# EasyEDA schematic Schematic.json
TITLE: 1D Ball Balancer; REV: 1.0; Date: 2024-08-14; Sheet: 1/1; Drawn By: Majrich Denis; Company: The Automation Warehouse
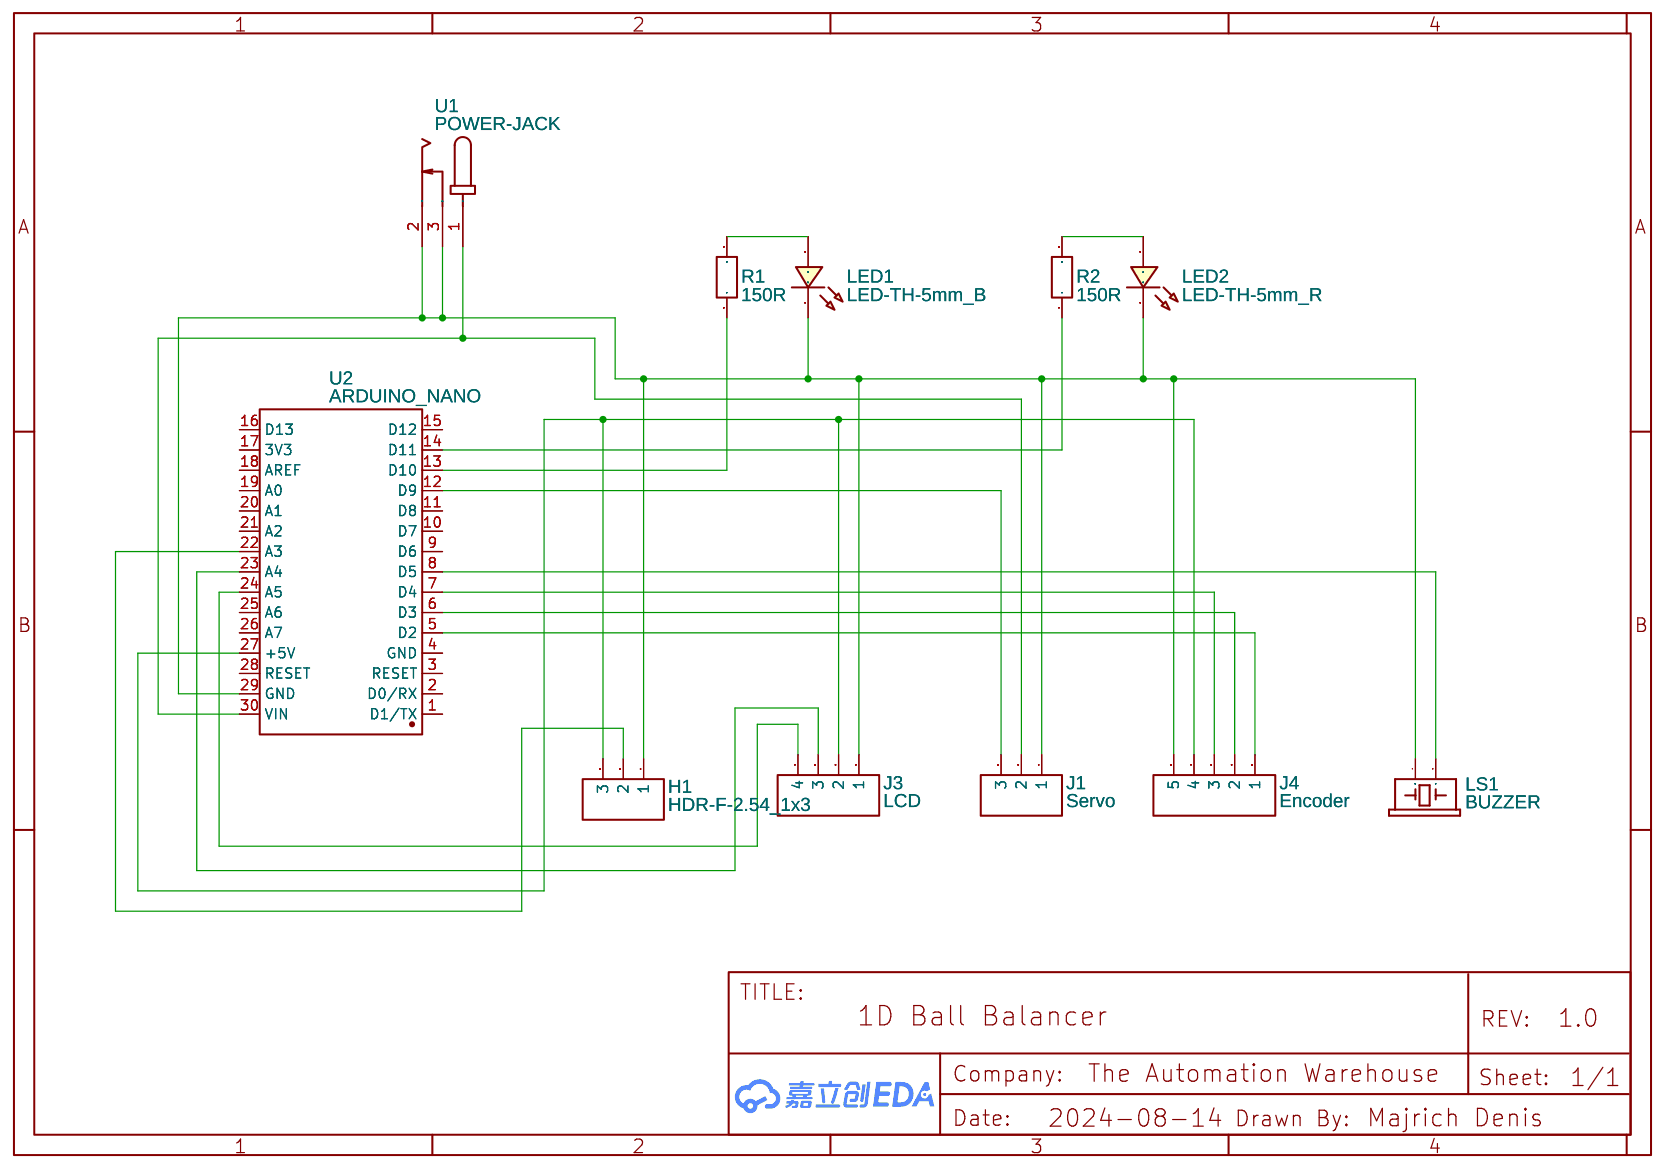
[diagram p0: schematic sheet]

## Parts
H1  HDR-F-2.54_1x3  [HDR-F-2.54_1X3]
J1  Servo  [HDR-M-2.54_1X3]
J3  LCD  [HDR-M-2.54_1X4]
J4  Encoder  [HDR-M-2.54_1X5]
LED1  LED-TH-5mm_B  [LED-TH_BD5.0_BLUE]
LED2  LED-TH-5mm_R  [LED-TH_BD5.0_RED]
LS1  BUZZER  [BUZZER-12MM-NS]
R1  150R  [R_AXIAL-0.4]
R2  150R  [R_AXIAL-0.4]
U1  POWER-JACK  [DC-IN-TH_POWER-JACK]
U2  ARDUINO_NANO  [COMM-TH_ARDUINO_NANO]

## Library data of the parts
H1 = HDR-F-2.54_1x3: Supplier Part: C146690; Supplier: LCSC; Contributor: LCEDA_Lib
J1 = HDR-M-2.54_1x3: Supplier Part: C180248; Supplier: LCSC; Contributor: LCEDA_Lib
J3 = HDR-M-2.54_1x4: Supplier Part: C124378; Supplier: LCSC; Contributor: LCEDA_Lib
J4 = HDR-M-2.54_1x5: Supplier Part: C358687; Supplier: LCSC; Contributor: LCEDA_Lib
LED1 = LED-TH-5mm_B: Supplier: LCSC; Contributor: LCEDA_Lib
LED2 = LED-TH-5mm_R: Manufacturer: EVERLIGHT(台湾亿光); Manufacturer Part: 333-2SURD/S530-A3; Supplier Part: C87271; Supplier: LCSC; Contributor: LCEDA_Lib
LS1 = BUZZER-PTH_NO_SILK: Contributor: super7800
R1 R2 = R_AXIAL-0.4_EU: Contributor: LCEDA_Lib
U1 = POWER-JACK: Supplier: LCSC; Supplier Part: C9900001795; Manufacturer: null; JLCPCB Part Class: Extended Part; Contributor: LCSC
U2 = ARDUINO_NANO: Contributor: lcsc; Supplier: LCSC; Supplier Part: C9900017879; Manufacturer: null; JLCPCB Part Class: Extended Part

## Nets
Net-(H1-1): H1.1 J1.1 J3.1 J4.5 LED1.2 LED2.2 LS1.-(2) U1.2 U1.3 U2.29(GND)
Net-(H1-2): H1.2 U2.22(A3)
Net-(H1-3): H1.3 J3.2 J4.4 U2.27(+5V)
Net-(J1-2): J1.2 U1.1 U2.30(VIN)
Net-(J1-3): J1.3 U2.12(D9)
Net-(J3-3): J3.3 U2.23(A4)
Net-(J3-4): J3.4 U2.24(A5)
Net-(J4-1): J4.1 U2.5(D2)
Net-(J4-2): J4.2 U2.6(D3)
Net-(J4-3): J4.3 U2.7(D4)
Net-(LED1-1): LED1.1 R1.2
Net-(LED2-1): LED2.1 R2.2
Net-(LS1-+): LS1.+(1) U2.8(D5)
Net-(R1-1): R1.1 U2.13(D10)
Net-(R2-1): R2.1 U2.14(D11)

Not connected (* = marked no-connect by the designer): U2 1(D1/TX) 2(D0/RX) 3(RESET) 4(GND) 9(D6) 10(D7) 11(D8) 15(D12) 16(D13) 17(3V3) 18(AREF) 19(A0) 20(A1) 21(A2) 25(A6) 26(A7) 28(RESET)
